# Altium project IEM_Receiver.PrjPCB
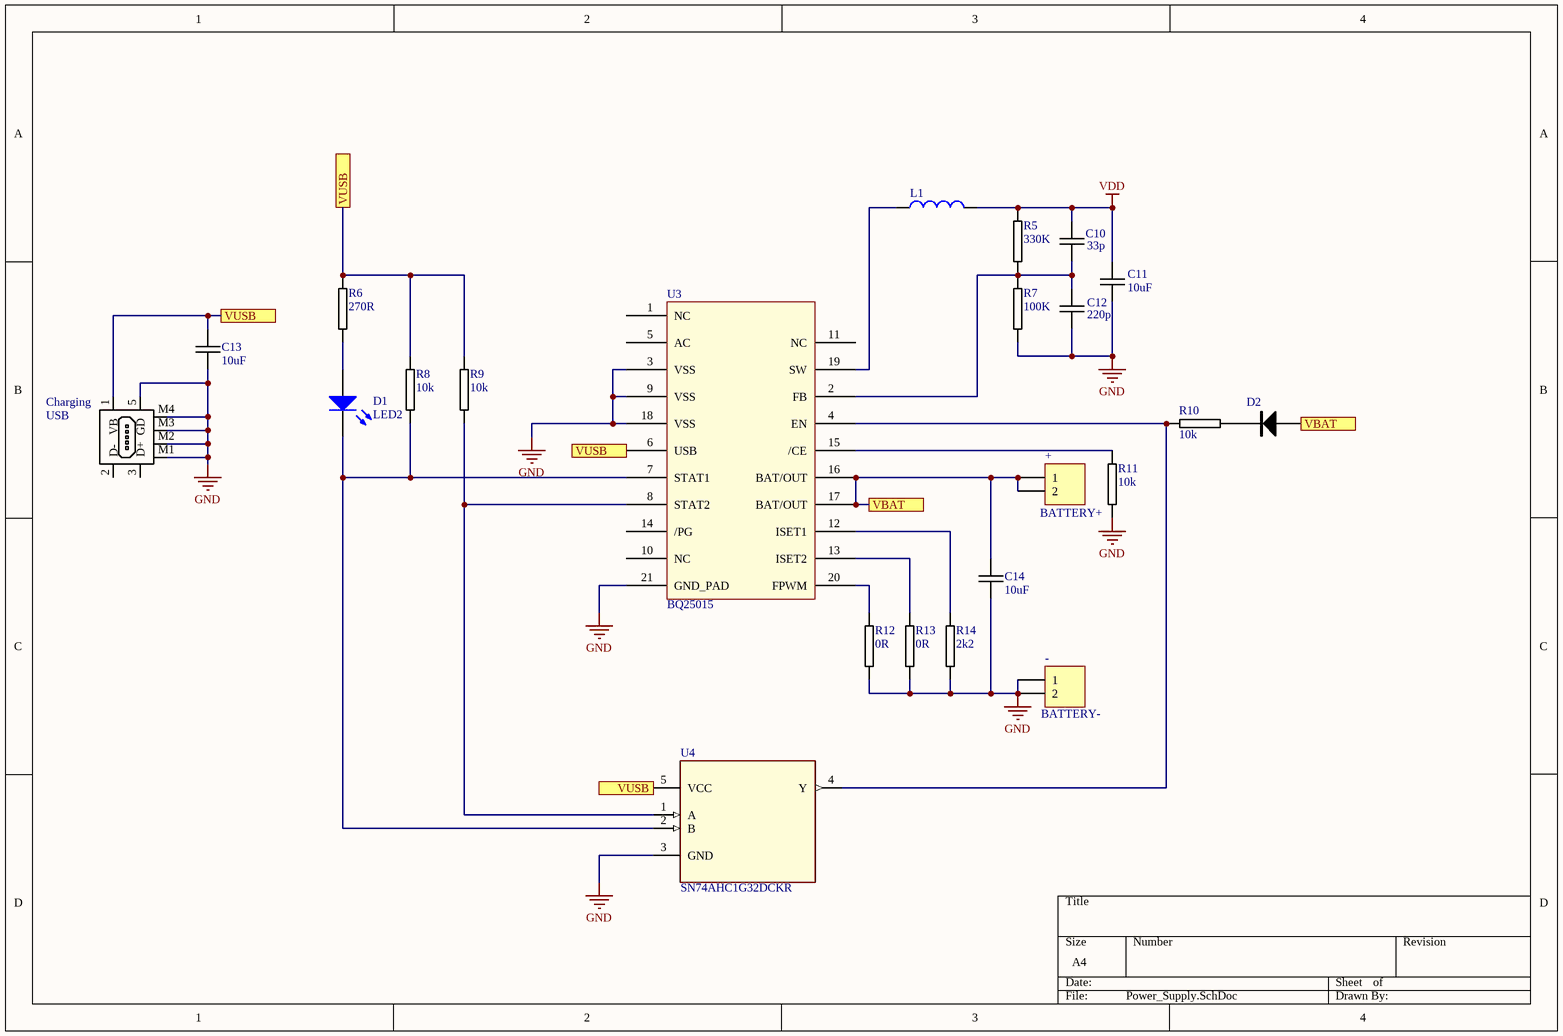
[diagram p0: Power_Supply.SchDoc]
3 sheets, 85 parts. Net scope: flat (ports and power ports of the same name join across sheets).
Board file: PCB.PcbDoc
Sheets:
  Power_Supply.SchDoc
  Receiver.SchDoc
  DAC.SchDoc

## Sheet Power_Supply.SchDoc
size A4

### Parts
+  BATTERY+  [HDR1X2]
-  BATTERY-  [HDR1X2]
C10  33p  [0402C-TBD]
C11  10uF  [0603C-GENERIC]
C12  220p  [0402C-TBD]
C13  10uF  [0603C-GENERIC]
C14  10uF  [0603C-GENERIC]
Charging  USB  [USB-MINI-B-51387-0571]
D1  LED2  [0402C-GENERIC]
D2  DIODE-GENERIC  [0603C-GENERIC]  (value not drawn)
L1  Inductor  [1210C-GENERIC]  (value not drawn)
R5  330K  [0402R-GENERIC]
R6  270R  [0402R-GENERIC]
R7  100K  [0402R-GENERIC]
R8  10k  [0402R-GENERIC]
R9  10k  [0402R-GENERIC]
R10  10k  [0402R-GENERIC]
R11  10k  [0402R-GENERIC]
R12  0R  [0402R-GENERIC]
R13  0R  [0402R-GENERIC]
R14  2k2  [0402R-GENERIC]
U3  BQ25015  [*CONV_BQ25015RHLT_BQ25015RHLT(Primary)]
U4  SN74AHC1G32DCKR  [*SOT65P210X110-5N]

### Ports
VBAT, VUSB

### Nets
GND: -.1 -.2 C11.2 C12.2 C13.2 C14.2 Charging.5(GD) Charging.M1 Charging.M2 Charging.M3 Charging.M4 R7.2 R11.2 R12.2 R13.2 R14.2 U3.3(VSS) U3.9(VSS) U3.18(VSS) U3.21(GND_PAD) U4.3(GND)
VDD: C10.1 C11.1 L1.2 R5.1  [project net AVDD_A]
Net+_1: +.1 +.2 C14.1 D2.A U3.16(BAT/OUT) U3.17(BAT/OUT) ; port VBAT
NetC10_2: C10.2 C12.1 R5.2 R7.1 U3.2(FB)
NetC13_1: C13.1 Charging.1(VB) R6.1 R8.1 R9.1 U3.6(USB) U4.5(VCC) ; port VUSB
NetD1_1: D1.1(A) R6.2
NetD1_2: D1.2(K) R8.2 U3.7(STAT1) U4.2(B)
NetD2_K: D2.K R10.2
NetL1_1: L1.1 U3.19(SW)
NetR9_2: R9.2 U3.8(STAT2) U4.1(A)
NetR10_1: R10.1 U3.4(EN) U4.4(Y)
NetR11_1: R11.1 U3.15(/CE)
NetR12_1: R12.1 U3.20(FPWM)
NetR13_1: R13.1 U3.13(ISET2)
NetR14_1: R14.1 U3.12(ISET1)

Not connected (* = marked no-connect by the designer): Charging 2(D-) 3(D+); U3 1(NC) 5(AC) 10(NC) 11(NC) 14(/PG)

### Library data of the parts
+ - = Header 2: Header, 2-Pin; LatestRevisionDate: 17-Jul-2002; LatestRevisionNote: Re-released for DXP Platform.; Publisher: Altium Limited
C10 C12 = 0402C-TBD: CAPACITOR 0402 CERAMIC
C11 C13 C14 = 0603C-10UF-10V-X5R-TDK: CAPACITOR 0603 CERAMIC; Manufacturer Part Number: C1608X5R0J106M; Manufacturer: TDK Corporation; Reel: C31; Supplier 1: Digi-Key; Supplier Part Number 1: 445-4112-2-ND
Charging = USB-MINI-B-MOLEX-51387-0571: MINI USB B DEVICE CONNECTOR MOLEX 51387-0571; Supplier 1: Digi-Key; Supplier Part Number 1: WM5462DKR-ND
D1 = LED2: Typical RED, GREEN, YELLOW, AMBER GaAs LED; Published: 8-Jun-2000; LatestRevisionDate: 17-Jul-2002; LatestRevisionNote: Re-released for DXP Platform.; PackageVersion: Feb-2002; PackageReference: 3.2X1.6X1.1; Publisher: Altium Limited; PackageDescription: SM LED; 2 Flat Leads
D2 = DIODE-GENERIC: GENERIC DIODE; pin to pad: A>1 K>2
L1 = Inductor: Code_IEC: 1005; Value: 6n8; Published: 8-Jun-2000; LatestRevisionDate: 29-May-2009; LatestRevisionNote: IPC-7351 Footprint Added.; PackageReference: 0402-A; Publisher: Altium Limited; PackageDescription: Chip Inductor; Code_JEITA: 0402
R5-R14 = 0402R-GENERIC: RESISTOR 0402 GENERIC
U3 = BQ25015: SINGLE-CHIPCHARGERANDDC/DCCONVERTERICFORPORTABLEAPPLICATIONS
U4 = SN74AHC1G32DCKR: Single 2-Input Positive-OR Gate 5-SC70 -40 to 125; MF: Texas Instruments; Digi-Key_Part_Number: 296-8749-1-ND; Digi-Key_Purchase_URL: https://www.digikey.com/product-detail/en/texas-instruments/SN74AHC1G32DCKR/296-8749-1-ND/373812?utm_source=snapeda&utm_medium=aggregator&utm_campaign=symbol; Package: SC-70-5 Texas Instruments; MP: SN74AHC1G32DCKR; SnapEDA_Link: https://www.snapeda.com/parts/SN74AHC1G32DCKR/Texas%20Instruments/view-part/429264/?ref=snap; Value: *

## Sheet Receiver.SchDoc
size A3; Organization: Altium Limited; Address1: L3, 12a Rodborough Rd; Address2: Frenchs Forest; Address3: NSW; Address4: Australia 2086
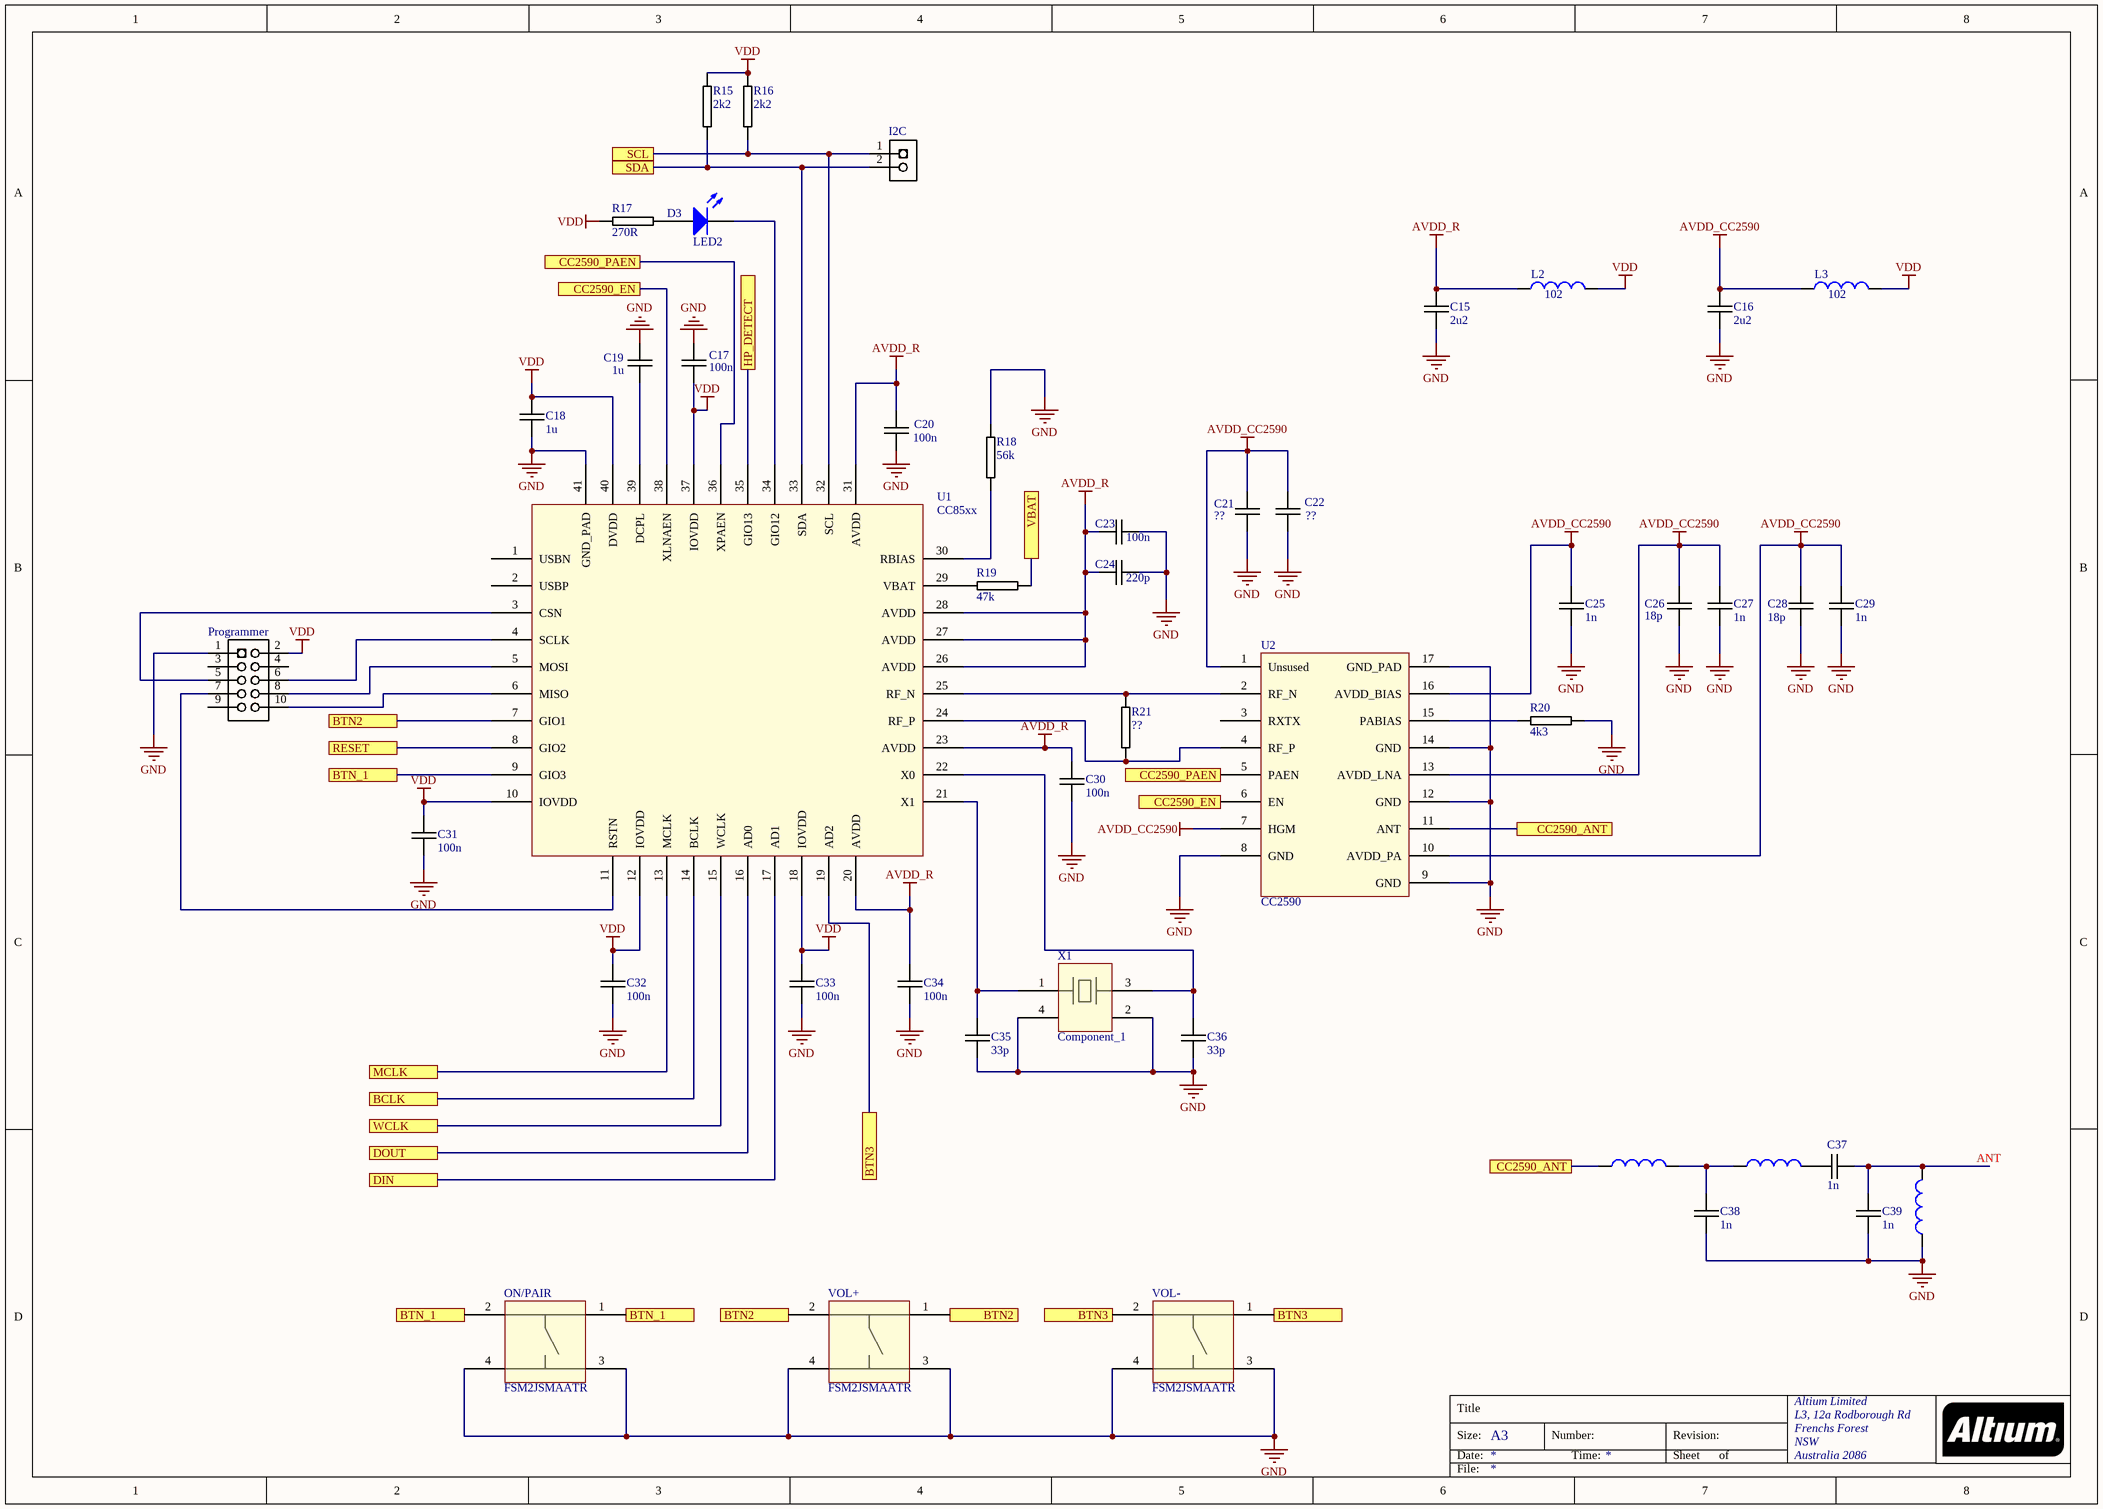
[diagram p1: Receiver.SchDoc]

### Parts
C15  2u2  [0402C-TBD]
C16  2u2  [0402C-TBD]
C17  100n  [0402C-TBD]
C18  1u  [0402C-TBD]
C19  1u  [0402C-TBD]
C20  100n  [0402C-TBD]
C21  ??  [0402C-TBD]
C22  ??  [0402C-TBD]
C23  100n  [0402C-TBD]
C24  220p  [0402C-TBD]
C25  1n  [0402C-TBD]
C26  18p  [0402C-TBD]
C27  1n  [0402C-TBD]
C28  18p  [0402C-TBD]
C29  1n  [0402C-TBD]
C30  100n  [0402C-TBD]
C31  100n  [0402C-TBD]
C32  100n  [0402C-TBD]
C33  100n  [0402C-TBD]
C34  100n  [0402C-TBD]
C35  33p  [0402C-TBD]
C36  33p  [0402C-TBD]
C37  1n  [0402C-TBD]
C38  1n  [0402C-TBD]
C39  1n  [0402C-TBD]
D3  LED2  [0402C-GENERIC]
I2C  I2C  [HEADER-1X2]  (value not drawn)
L2  value 102  [0402-A]  (hidden comment: Inductor)
L3  value 102  [0402-A]  (hidden comment: Inductor)
L11  Inductor  [0402-A]  (value not drawn)
L12  Inductor  [0402-A]  (value not drawn)
L13  Inductor  [0402-A]  (value not drawn)
ON/PAIR  FSM2JSMAATR  [Tactile Button]
Programmer  Programm  [HEADER-2X5]  (value not drawn)
R15  2k2  [0402R-GENERIC]
R16  2k2  [0402R-GENERIC]
R17  270R  [0402R-GENERIC]
R18  56k  [0402R-GENERIC]
R19  47k  [0402R-GENERIC]
R20  4k3  [0402R-GENERIC]
R21  ??  [0402R-GENERIC]
U1  CC85xx  [QFN40]
U2  CC2590  [QFN16]
VOL+  FSM2JSMAATR  [Tactile Button]
VOL-  FSM2JSMAATR  [Tactile Button]
X1  Component_1  [*XTALDFN200X160X70-4N]

### Ports
BCLK, BTN2, BTN3, BTN_1, CC2590_ANT, CC2590_EN, CC2590_PAEN, DIN, DOUT, HP_DETECT, MCLK, RESET, SCL, SDA, VBAT, WCLK

### Nets
AVDD_CC2590: C16.1 C21.1 C22.1 C25.1 C26.1 C27.1 C28.1 C29.1 L3.1 U2.1(Unsused) U2.7(HGM) U2.10(AVDD_PA) U2.13(AVDD_LNA) U2.16(AVDD_BIAS)
AVDD_R: C15.1 C20.1 C23.2 C24.2 C30.1 C34.1 L2.1 U1.20(AVDD) U1.23(AVDD) U1.26(AVDD) U1.27(AVDD) U1.28(AVDD) U1.31(AVDD)
GND: C15.2 C16.2 C17.1 C18.2 C19.1 C20.2 C21.2 C22.2 C23.1 C24.1 C25.2 C26.2 C27.2 C28.2 C29.2 C30.2 C31.2 C32.2 C33.2 C34.2 C35.2 C36.2 C38.2 C39.2 L13.1 ON/PAIR.3 ON/PAIR.4 Programmer.1 R18.1 R20.2 U1.41(GND_PAD) U2.8(GND) U2.9(GND) U2.12(GND) U2.14(GND) U2.17(GND_PAD) VOL+.3 VOL+.4 VOL-.3 VOL-.4 X1.2 X1.4
VDD: C17.2 C18.1 C31.1 C32.1 C33.1 L2.2 L3.2 Programmer.2 R15.1 R16.1 R17.1 U1.10(IOVDD) U1.12(IOVDD) U1.18(IOVDD) U1.37(IOVDD) U1.40(DVDD)  [project net AVDD_A]
Net+_1: R19.2 ; port VBAT
NetC19_2: C19.2 U1.39(DCPL)
NetC35_1: C35.1 U1.21(X1) X1.1
NetC36_1: C36.1 U1.22(X0) X1.3
NetC37_1: C37.1 L12.2
NetC37_2: C37.2 C39.1 L13.2
NetC38_1: C38.1 L11.2 L12.1
NetD3_1: D3.1(A) R17.2
NetD3_2: D3.2(K) U1.34(GIO12)
NetI2C_1: I2C.1 R16.2 U1.32(SCL) ; port SCL
NetI2C_2: I2C.2 R15.2 U1.33(SDA) ; port SDA
NetL11_1: L11.1 U2.11(ANT) ; port CC2590_ANT
NetON/PAIR_1: ON/PAIR.1 ON/PAIR.2 U1.9(GIO3) ; port BTN_1
NetProgrammer_5: Programmer.5 U1.3(CSN)
NetProgrammer_6: Programmer.6 U1.4(SCLK)
NetProgrammer_7: Programmer.7 U1.11(RSTN)
NetProgrammer_8: Programmer.8 U1.5(MOSI)
NetProgrammer_10: Programmer.10 U1.6(MISO)
NetR18_2: R18.2 U1.30(RBIAS)
NetR19_1: R19.1 U1.29(VBAT)
NetR20_1: R20.1 U2.15(PABIAS)
NetR21_1: R21.1 U1.24(RF_P) U2.4(RF_P)
NetR21_2: R21.2 U1.25(RF_N) U2.2(RF_N)
NetU1_7: U1.7(GIO1) VOL+.1 VOL+.2 ; port BTN2
NetU1_8: U1.8(GIO2) ; port RESET
NetU1_13: U1.13(MCLK) ; port MCLK
NetU1_14: U1.14(BCLK) ; port BCLK
NetU1_15: U1.15(WCLK) ; port WCLK
NetU1_16: U1.16(AD0) ; port DOUT
NetU1_17: U1.17(AD1) ; port DIN
NetU1_19: U1.19(AD2) VOL-.1 VOL-.2 ; port BTN3
NetU1_35: U1.35(GIO13) ; port HP_DETECT
NetU1_36: U1.36(XPAEN) U2.5(PAEN) ; port CC2590_PAEN
NetU1_38: U1.38(XLNAEN) U2.6(EN) ; port CC2590_EN

Not connected (* = marked no-connect by the designer): Programmer 3 4 9; U1 1(USBN) 2(USBP); U2 3(RXTX)

### Notes on the sheet
- ANT
- Title
- Size:
- Date:
- A3
- Number:
- Time:
- Revision:
- Sheet
- of
- File:

### Library data of the parts
C15-C39 = 0402C-TBD: CAPACITOR 0402 CERAMIC
D3 = LED2: as D1 on sheet Power_Supply; Published: 8-Jun-2000; LatestRevisionDate: 17-Jul-2002; LatestRevisionNote: Re-released for DXP Platform.; PackageVersion: Feb-2002; PackageReference: 3.2X1.6X1.1; Publisher: Altium Limited; PackageDescription: SM LED; 2 Flat Leads
I2C = HEADER-1X2: REEL: TH; Supplier 1: Digi-Key; Supplier Part Number 1: S1011E-36-ND
L2 L3 = Inductor: Code_IEC: 1005; Published: 8-Jun-2000; LatestRevisionDate: 29-May-2009; LatestRevisionNote: IPC-7351 Footprint Added.; PackageReference: 0402-A; Publisher: Altium Limited; PackageDescription: Chip Inductor; Code_JEITA: 0402
L11-L13 = Inductor: Code_IEC: 1005; Value: 6n8; Published: 8-Jun-2000; LatestRevisionDate: 29-May-2009; LatestRevisionNote: IPC-7351 Footprint Added.; PackageReference: 0402-A; Publisher: Altium Limited; PackageDescription: Chip Inductor; Code_JEITA: 0402
ON/PAIR VOL+ VOL- = FSM2JSMAATR: Tactile Button
Programmer = HEADER-2X5
R15-R21 = 0402R-GENERIC: RESISTOR 0402 GENERIC
U1 = CC85xx: 2.4 GHz RF SoC FOR WIRELESS DIGITAL AUDIO STREAMING CC8520, CC8521, CC8530 & CC8531 - PurePath™ Wireless
U2 = CC2590: 2.4-GHzRFFrontEnd,14-dBmoutputpower

## Sheet DAC.SchDoc
size A4; Organization: Altium Limited; Address1: L3, 12a Rodborough Rd; Address2: Frenchs Forest; Address3: NSW; Address4: Australia 2086
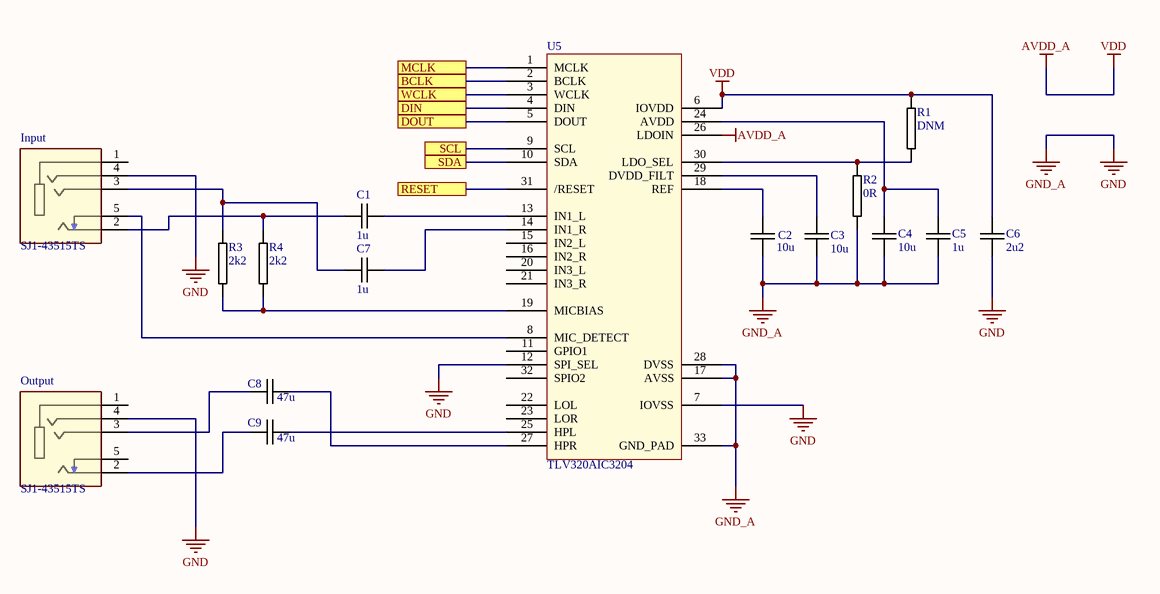
[diagram p2: DAC.SchDoc]

### Parts
C1  1u  [0402C-TBD]
C2  10u  [0603C-GENERIC]
C3  10u  [0603C-GENERIC]
C4  10u  [0603C-GENERIC]
C5  1u  [0402C-TBD]
C6  2u2  [0402C-TBD]
C7  1u  [0402C-TBD]
C8  47u  [1206C-GENERIC]
C9  47u  [1206C-GENERIC]
Input  SJ1-43515TS  [CUI_SJ-43515TS]
Output  SJ1-43515TS  [CUI_SJ-43515TS]
R1  DNM  [0402R-GENERIC]
R2  0R  [0402R-GENERIC]
R3  2k2  [0402R-GENERIC]
R4  2k2  [0402R-GENERIC]
U5  TLV320AIC3204  [QFN32]

### Ports
BCLK, DIN, DOUT, MCLK, RESET, SCL, SDA, WCLK

### Nets
AVDD_A: C6.1 R1.2 U5.6(IOVDD) U5.26(LDOIN)  [also labelled VDD]
GND: C2.2 C3.2 C4.2 C5.2 C6.2 Input.4 Output.4 R2.1 U5.7(IOVSS) U5.12(SPI_SEL) U5.17(AVSS) U5.28(DVSS) U5.33(GND_PAD)  [also labelled GND_A]
NetC1_1: C1.1 Input.2 R4.2
NetC1_2: C1.2 U5.13(IN1_L)
NetC2_1: C2.1 U5.18(REF)
NetC3_1: C3.1 U5.29(DVDD_FILT)
NetC4_1: C4.1 C5.1 U5.24(AVDD)
NetC7_1: C7.1 U5.14(IN1_R)
NetC7_2: C7.2 Input.3 R3.2
NetC8_1: C8.1 U5.27(HPR)
NetC8_2: C8.2 Output.3
NetC9_1: C9.1 U5.25(HPL)
NetC9_2: C9.2 Output.2
NetI2C_1: U5.9(SCL) ; port SCL
NetI2C_2: U5.10(SDA) ; port SDA
NetInput_5: Input.5 U5.8(MIC_DETECT)
NetR1_1: R1.1 R2.2 U5.30(LDO_SEL)
NetR3_1: R3.1 R4.1 U5.19(MICBIAS)
NetU1_8: U5.31(/RESET) ; port RESET
NetU1_13: U5.1(MCLK) ; port MCLK
NetU1_14: U5.2(BCLK) ; port BCLK
NetU1_15: U5.3(WCLK) ; port WCLK
NetU1_16: U5.5(DOUT) ; port DOUT
NetU1_17: U5.4(DIN) ; port DIN

Not connected (* = marked no-connect by the designer): Input 1; Output 1 5; U5 11(GPIO1) 15(IN2_L) 16(IN2_R) 20(IN3_L) 21(IN3_R) 22(LOL) 23(LOR) 32(SPIO2)

### Notes on the sheet
- Title
- Size:
- Date:
- A4
- Number:
- Time:
- Revision:
- Sheet
- of
- File:

### Library data of the parts
C1 C5-C7 = 0402C-TBD: CAPACITOR 0402 CERAMIC
C2-C4 = 0603C-000: CAPACITOR 0603 CERAMIC
C8 C9 = 1206C-2U2-50V: CAPACITOR 0603 CERAMIC; REEL: C100; Supplier 1: Digi-Key; Supplier Part Number 1: 490-4796-2-ND
Input Output = SJ1-42515TS: 2.5 mm, 4 Conductors, Right Angle, Through Hole, Audio Jack Connector; MF: CUI Devices; Price: None; Availability: Unavailable; Package: None; SnapEDA_Link: https://www.snapeda.com/parts/SJ1-42515TS/CUI%20Devices/view-part/1320737/?ref=snap; MP: SJ1-42515TS; CUI_purchase_URL: https://www.cuidevices.com/product/interconnect/connectors/audio-connectors/jacks/sj1-4251x-series?utm_source=snapeda.com&utm_medium=referral&utm_campaign=snapedaBOM; Value: *
R1-R4 = 0402R-GENERIC: RESISTOR 0402 GENERIC
U5 = TLV320AIC3204: The TLV320AIC3204(alsocalledthe AIC3204)is aflexible,low-power,low-voltagestereoaudiocodecwithprogrammableinputsand outputs,PowerTunecapabilities,fixedpredefinedandparameterizablesignal-processingblocks,integratedPLL,integratedLDOsand flexibledigitalinterfaces.

## Nets that join several sheets
AVDD_A: Power_Supply (C10.1 C11.1 L1.2 R5.1), Receiver (16 pins), DAC (C6.1 R1.2 U5.6 U5.26)
GND: Power_Supply (21 pins), Receiver (42 pins), DAC (13 pins)
Net+_1: Power_Supply (6 pins), Receiver (R19.2)
NetI2C_1: Receiver (I2C.1 R16.2 U1.32), DAC (U5.9)
NetI2C_2: Receiver (I2C.2 R15.2 U1.33), DAC (U5.10)
NetU1_8: Receiver (U1.8), DAC (U5.31)
NetU1_13: Receiver (U1.13), DAC (U5.1)
NetU1_14: Receiver (U1.14), DAC (U5.2)
NetU1_15: Receiver (U1.15), DAC (U5.3)
NetU1_16: Receiver (U1.16), DAC (U5.5)
NetU1_17: Receiver (U1.17), DAC (U5.4)